# Altium schematic sheet EPF-100 MP3.SchDoc
size A4
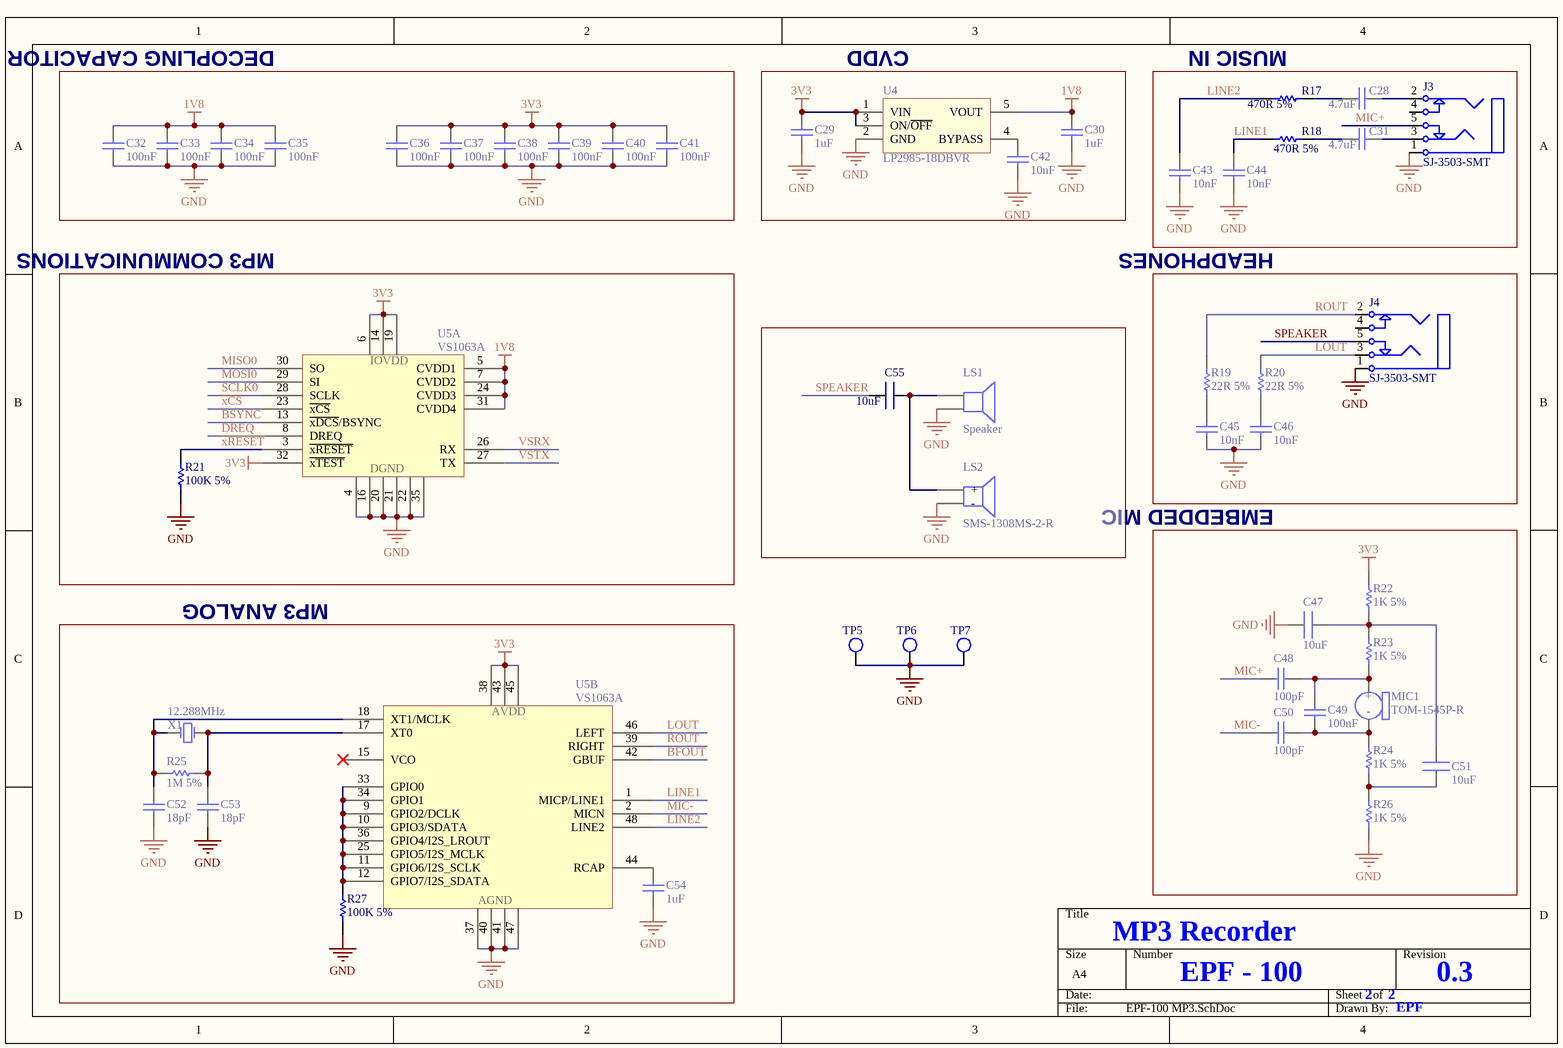
[diagram p0: EPF-100 MP3.SchDoc]

## Parts
C28  4.7uF  [CAP0603]
C29  1uF  [CAP0603]
C30  1uF  [CAP0603]
C31  4.7uF  [CAP0603]
C32  100nF  [CAP0603]
C33  100nF  [CAP0603]
C34  100nF  [CAP0603]
C35  100nF  [CAP0603]
C36  100nF  [CAP0603]
C37  100nF  [CAP0603]
C38  100nF  [CAP0603]
C39  100nF  [CAP0603]
C40  100nF  [CAP0603]
C41  100nF  [CAP0603]
C42  10nF  [CAP0603]
C43  10nF  [CAP0603]
C44  10nF  [CAP0603]
C45  10nF  [CAP0603]
C46  10nF  [CAP0603]
C47  10uF  [CAP0805]
C48  100pF  [CAP0603]
C49  100nF  [CAP0603]
C50  100pF  [CAP0603]
C51  10uF  [CAP0805]
C52  18pF  [CAP0603]
C53  18pF  [CAP0603]
C54  1uF  [CAP0603]
C55  10uF  [CAP0805]
J3  SJ-3503-SMT  [SJ-3503-SMT]
J4  SJ-3503-SMT  [SJ-3503-SMT]
LS1  Speaker  [HDR1X2 - Speaker]
LS2  SMS-1308MS-2-R  [SMS-1308MS-2-R]
MIC1  TOM-1545P-R  [TOM-154P-R]
R17  470R 5%  [RES0603]
R18  470R 5%  [RES0603]
R19  22R 5%  [RES0603]
R20  22R 5%  [RES0603]
R21  100K 5%  [RES0603]
R22  1K 5%  [RES0603]
R23  1K 5%  [RES0603]
R24  1K 5%  [RES0603]
R25  1M 5%  [RES0603]
R26  1K 5%  [RES0603]
R27  100K 5%  [RES0603]
TP5  PCB TEST POINT  [PCB TEST POINT]  (value not drawn)
TP6  PCB TEST POINT  [PCB TEST POINT]  (value not drawn)
TP7  PCB TEST POINT  [PCB TEST POINT]  (value not drawn)
U4  LP2985-18DBVR  [SOT23-5BN]
U5  VS1063A  [TQFP48_N - VLSI]  (parts A,B of 2)
X1  12.288MHz  [SMD XTAL ABM3B]

## Blocks framed on the sheet
HEADPHONES: C28 C31 C43 C44 J3 R17 R18
EMBEDDED MIC: C45 C46 J4 R19 R20

## Nets
1V8: C30.2 C32.2 C33.2 C34.2 C35.2 U4.5(VOUT) U5.5(CVDD1) U5.7(CVDD2) U5.24(CVDD3) U5.31(CVDD4)
3V3: C29.2 C36.2 C37.2 C38.2 C39.2 C40.2 C41.2 R22.2 U4.1(VIN) U4.3(ON/~{OFF}) U5.6(IOVDD1) U5.14(IOVDD2) U5.19(IOVDD3) U5.32(~{xTEST}) U5.38(AVDD1) U5.43(AVDD2) U5.45(AVDD3)
GND: C29.1 C30.1 C32.1 C33.1 C34.1 C35.1 C36.1 C37.1 C38.1 C39.1 C40.1 C41.1 C42.1 C43.1 C44.1 C45.2 C46.2 C47.2 C52.2 C53.2 C54.1 J3.1 J4.1 LS1.2 LS2.2(-) R21.1 R26.1 R27.1 TP5.1 TP6.1 TP7.1 U4.2(GND) U5.4(DGND1) U5.16(DGND2) U5.20(DGND3) U5.21(DGND4) U5.22(DGND5) U5.35(DGND6) U5.37(AGND1) U5.40(AGND2) U5.41(AGND3) U5.47(AGND4)
BFOUT: U5.42(GBUF)
BSYNC: U5.13(~{xDCS}/BSYNC)
DREQ: U5.8(DREQ)
LINE1: C44.2 R18.1 U5.1(MICP/LINE1)
LINE2: C43.2 R17.1 U5.48(LINE2)
LOUT: J4.3 R20.1 U5.46(LEFT)
MIC+: C48.2 J3.5
MIC-: C50.2 U5.2(MICN)
MISO0: U5.30(SO)
MOSI0: U5.29(SI)
ROUT: J4.2 R19.1 U5.39(RIGHT)
SCLK0: U5.28(SCLK)
SPEAKER: C55.1 J4.5
VSRX: U5.26(RX)
VSTX: U5.27(TX)
~{xCS}: U5.23(~{xCS})
~{xRESET}: R21.2 U5.3(~{xRESET})
NetC28_1: C28.1 J3.2
NetC28_2: C28.2 R17.2
NetC31_1: C31.1 J3.3
NetC31_2: C31.2 R18.2
NetC42_2: C42.2 U4.4(BYPASS)
NetC45_1: C45.1 R19.2
NetC46_1: C46.1 R20.2
NetC47_1: C47.1 C51.1 R22.1 R23.2
NetC48_1: C48.1 C49.2 MIC1.1(Term_+) R23.1
NetC49_1: C49.1 C50.1 MIC1.2(Term_-) R24.2
NetC51_2: C51.2 R24.1 R26.2
NetC52_1: C52.1 R25.2 U5.18(XT1/MCLK) X1.3
NetC53_1: C53.1 R25.1 U5.17(XT0) X1.1
NetC54_2: C54.2 U5.44(RCAP)
NetC55_2: C55.2 LS1.1 LS2.1(+)
NetR27_2: R27.2 U5.9(GPIO2/DCLK) U5.10(GPIO3/SDATA) U5.11(GPIO6/I2S_SCLK) U5.12(GPIO7/I2S_SDATA) U5.25(GPIO5/I2S_MCLK) U5.33(GPIO0) U5.34(GPIO1) U5.36(GPIO4/I2S_LROUT)

Not connected (* = marked no-connect by the designer): J3 4; J4 4; U5 15(VCO)*

## Notes on the sheet
- DECOPLING CAPACITOR
- (near U4) CVDD
- MUSIC IN
- MP3 COMMUNICATIONS
- MP3 ANALOG
- MP3 Recorder
- EPF - 100
- 2
- 0.3
- EPF
- (in symbol PTH ELECTRET MIC) +; -
- (in symbol VS1063A, part A) IOVDD; DGND
- (in symbol VS1063A, part B) AVDD; AGND

## Library data of the parts
C28 C31 = CAP 4.7uF: X7R Ceramic Capacitors - SMD 0603; Manufacturer P/N: GRM188R60J475KE19D; Manufacturer: Murata Electronics; Value: 4.7uF 6.3V; Package: 0603; Price USD (1000pcs): 0.025; Tolerance: X7R
C29 C30 C54 = CAP 1uF: X7R Ceramic Capacitors - SMD 0603; Manufacturer P/N: C1608X5R1H105KT; Manufacturer: TDK; Value: 1uF 50V; Package: 0603; Price USD (1000pcs): 0.006; Tolerance: X7R
C32-C41 C49 = CAP 100nF: X7R Ceramic Capacitors - SMD 0603; Manufacturer P/N: C1608X7R1H104KT; Manufacturer: TDK; Value: 100nF 50V; Package: 0603; Price USD (1000pcs): 0.007; Tolerance: X7R
C42-C46 = CAP 10nF: X7R Ceramic Capacitors - SMD 0603; Manufacturer P/N: C1608X7R1H103KT; Manufacturer: TDK; Value: 10nF 50V; Package: 0603; Price USD (1000pcs): 0.004; Tolerance: X7R
C47 C51 C55 = CAP CER 0805 X5R 10uF 35V: X5R Ceramic Capacitors - SMD 0805; Package: 0805; Tolerance: X5R; Value: 10uF 35V
C48 C50 = CAP 100pF: C0G Ceramic Capacitors - SMD 0603; Manufacturer P/N: C1608C0G1H101JT; Manufacturer: TDK; Value: 100pF 50V; Package: 0603; Price USD (1000pcs): 0.007; Tolerance: C0G
C52 C53 = CAP 18pF: C0G Ceramic Capacitors - SMD 0603; Manufacturer P/N: GRM1885C1H180JA01D; Manufacturer: Murata; Value: 18pF 50V; Package: 0603; Tolerance: C0G
J3 J4 = SJ-3503-SMT: 3-Conductor Jack with 2 break contacts (normals) and 2 auxiliary make contacts
LS1 = Speaker: Loudspeaker
LS2 = SMS-1308MS-2-R: Loudspeaker; Manufacturer: PUI Audio; Manufacturer P/N: SMS-1308MS-2-R
MIC1 = PTH ELECTRET MIC
R17 R18 = RES 470R: 5% Thick Film Resistors - SMD 0603; Manufacturer P/N: CR0603-JW-471ELF; Manufacturer: Bourns; Value: 470R 1/10W; Package: 0603; Price USD (1000pcs): 0.01; Tolerance: 5%
R19 R20 = RES 22R: 5% Thick Film Resistors - SMD 0603; Manufacturer P/N: CR0603-JW-222ELF; Manufacturer: Bourns; Value: 22R 1/10W; Package: 0603; Price USD (1000pcs): 0.008; Tolerance: 5%
R21 R27 = RES 100K: 5% Thick Film Resistors - SMD 0603; Manufacturer P/N: CR0603-JW-104ELF; Manufacturer: Bourns; Value: 100K 1/10W; Package: 0603; Price USD (1000pcs): 0.01; Tolerance: 5%
R22-R24 R26 = RES 1K: 5% Thick Film Resistors - SMD 0603; Manufacturer P/N: CR0603-JW-102ELF; Manufacturer: Bourns; Value: 1K 1/10W; Package: 0603; Price USD (1000pcs): 0.008; Tolerance: 5%
R25 = RES 1M: 5% Thick Film Resistors - SMD 0603; Manufacturer P/N: CR0603-JW-105ELF; Manufacturer: Bourns; Value: 1M 1/10W; Package: 0603; Price USD (1000pcs): 0.01; Tolerance: 5%
U4 = LP2985: 1.8V Current 150mA; Manufacturer: Texas Instruments; Manufacturer P/N: LP2985-18DBVR
U5 = VS1063A: MP3 Encoder/Decoder; Package: LQFP-48; Manufacturer P/N: VS1063A
X1 = SMD XTAL 12.288MHz ABM3B: CERAMIC SURFACE MOUNT MICROPROCESSOR CRYSTAL; Manufacturer P/N: ABM3B-12.288MHZ-B2-T; Manufacturer: ABRACON